# Altium schematic sheet power_supply.SchDoc
size 297 x 209 mm
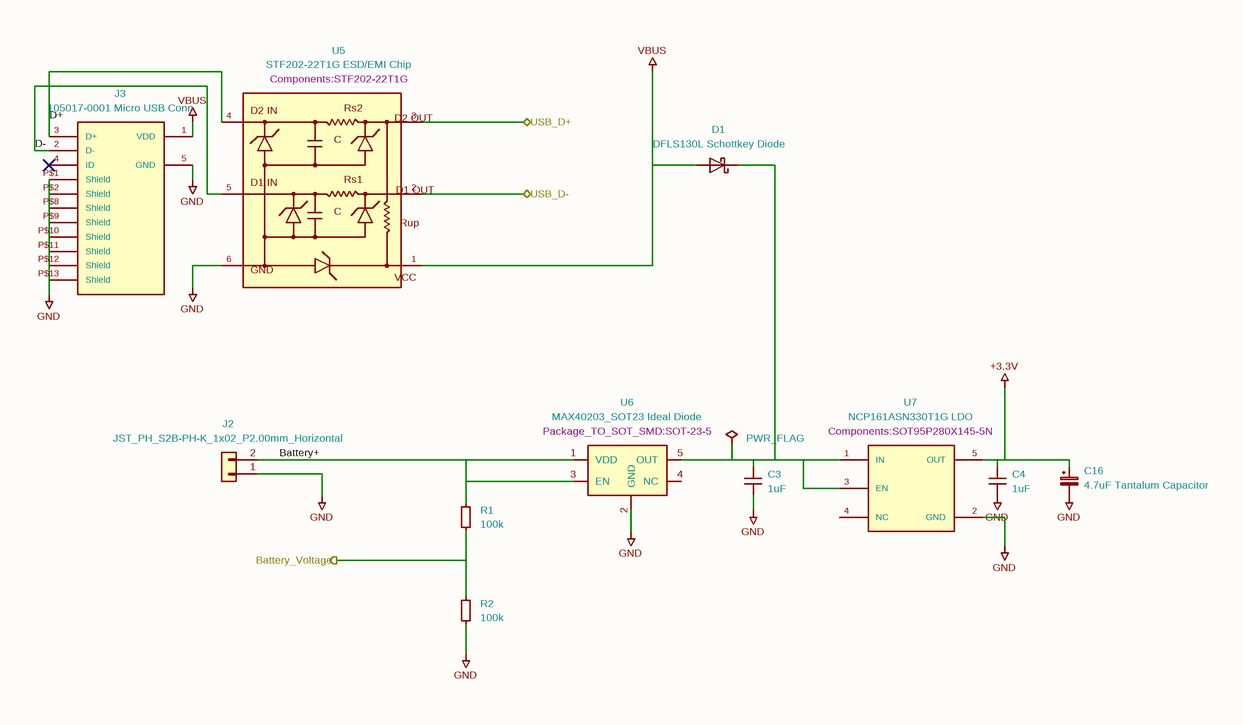
[diagram p0: power_supply.SchDoc]

## Parts
#FLG0102  PWR_FLAG  (graphical)
C3  1uF  [C_0603_1608Metric]
C4  1uF  [C_0603_1608Metric]
C16  4.7uF Tantalum Capacitor  [C_1206_3216Metric_Pad1.33x1.80mm_HandSolder]
D1  DFLS130L Schottkey Diode  [PowerDI123]
J2  JST_PH_S2B-PH-K_1x02_P2.00mm_Horizontal  [JST_PH_S2B-PH-K_1x02_P2.00mm_Horizontal]
J3  105017-0001 Micro USB Conn  [MOLEX_105017-0001]
R1  100k  [R_0603_1608Metric]
R2  100k  [R_0603_1608Metric]
U5  Footprint: Components:STF202-22T1G  [STF202-22T1G]  (hidden comment: STF202-22T1G ESD/EMI Chip)
U6  Footprint: Package_TO_SOT_SMD:SOT-23-5  [SOT-23-5]  (hidden comment: MAX40203_SOT23 Ideal Diode)
U7  Footprint: Components:SOT95P280X145-5N  [SOT95P280X145-5N]  (hidden comment: NCP161ASN330T1G LDO)

## Ports
Battery_Voltage (out), USB_D+ (bidir), USB_D- (bidir)

## Nets
+3.3V: C4.1 C16.1 U7.5(OUT)
GND: C3.2 C4.2 C16.2 J2.1(Pin_1) J3.5(GND) J3.P$1(Shield) J3.P$2(Shield) J3.P$8(Shield) J3.P$9(Shield) J3.P$10(Shield) J3.P$11(Shield) J3.P$12(Shield) J3.P$13(Shield) R2.2 U5.6 U6.2(GND) U7.2(GND)
VBUS: D1.2(A) J3.1(VDD) U5.1
Battery+: J2.2(Pin_2) R1.1 U6.1(VDD) U6.3(EN)
Battery_Voltage: R1.2 R2.1 ; port Battery_Voltage
D+: J3.3(D+) U5.4
D-: J3.2(D-) U5.5
USB_D+: U5.3 ; port USB_D+
USB_D-: U5.2 ; port USB_D-
Net#FLG0102_1: #FLG0102.1(pwr) C3.1 D1.1(K) U6.5(OUT) U7.1(IN) U7.3(EN)

Not connected (* = marked no-connect by the designer): J3 4(ID)*; U6 4(NC); U7 4(NC)

## Notes on the sheet
- 1
- 2
- 3
- 4
- 5
- 6
- A
- B
- C
- D
- Title:
- File: power_supply.kicad_sch
- Sheet: /
- KiCad E.D.A.  kicad (5.1.4)-1
- Size: A4
- Date:
- Rev:
- Id: 1/1
- (in symbol STF202-22T1G) D2 IN; Rs2; D2 OUT; C; D1 IN; Rs1; D1 OUT; Rup; GND; VCC

## Library data of the parts
C3 C4 = C_0603: Value: 1uF; Footprint: Components:C_0603_1608Metric
C16 = C_Polarized_Small: Value: 4.7uF Tantalum Capacitor; Footprint: Capacitor_SMD:C_1206_3216Metric_Pad1.33x1.80mm_HandSolder
D1 = DFLS130L: Value: DFLS130L Schottkey Diode; Footprint: Components:PowerDI123
J2 = Conn_01x02: Value: JST_PH_S2B-PH-K_1x02_P2.00mm_Horizontal; Footprint: Components:JST_PH_S2B-PH-K_1x02_P2.00mm_Horizontal
J3 = 105017-0001: Value: 105017-0001 Micro USB Conn
R1 R2 = R_0603: Value: 100k; Footprint: Components:R_0603_1608Metric
U5 = STF202-22T1G: Value: STF202-22T1G ESD/EMI Chip
U6 = MAX40203_SOT23: Value: MAX40203_SOT23 Ideal Diode
U7 = NCP161ASN180T1G: MANUFACTURER: Onsemi; PARTREV: Rev. 18; SNAPEDA_PN: NCP161ASN180T1G; STANDARD: IPC-7351B; MAXIMUM_PACKAGE_HEIGHT: 1.45 mm; Value: NCP161ASN330T1G LDO
#FLG0102 = PWR_FLAG: Value: PWR_FLAG